# Altium project USBHub3.2G1.PrjPcb
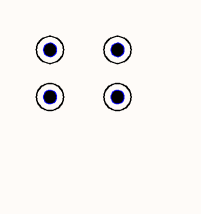
[diagram p0: Schematic.SchDoc, top left]
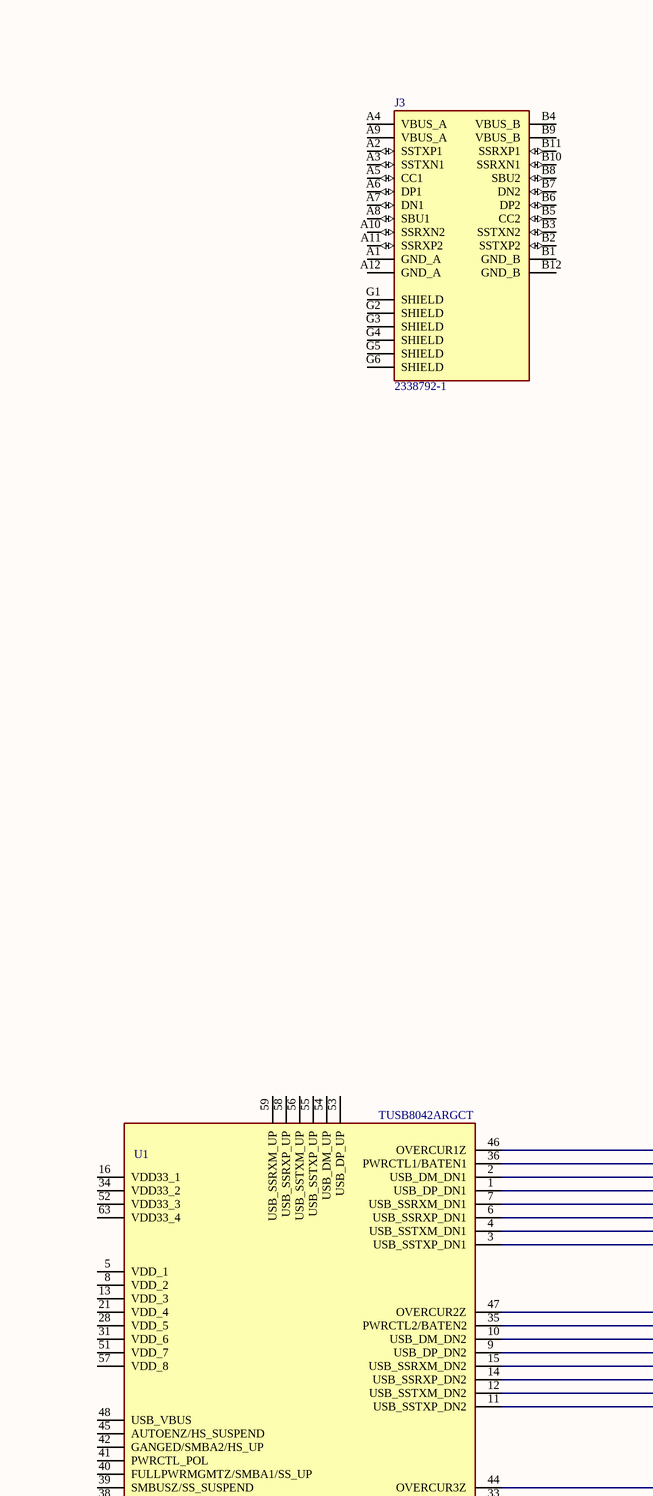
[diagram p1: Schematic.SchDoc, top middle]
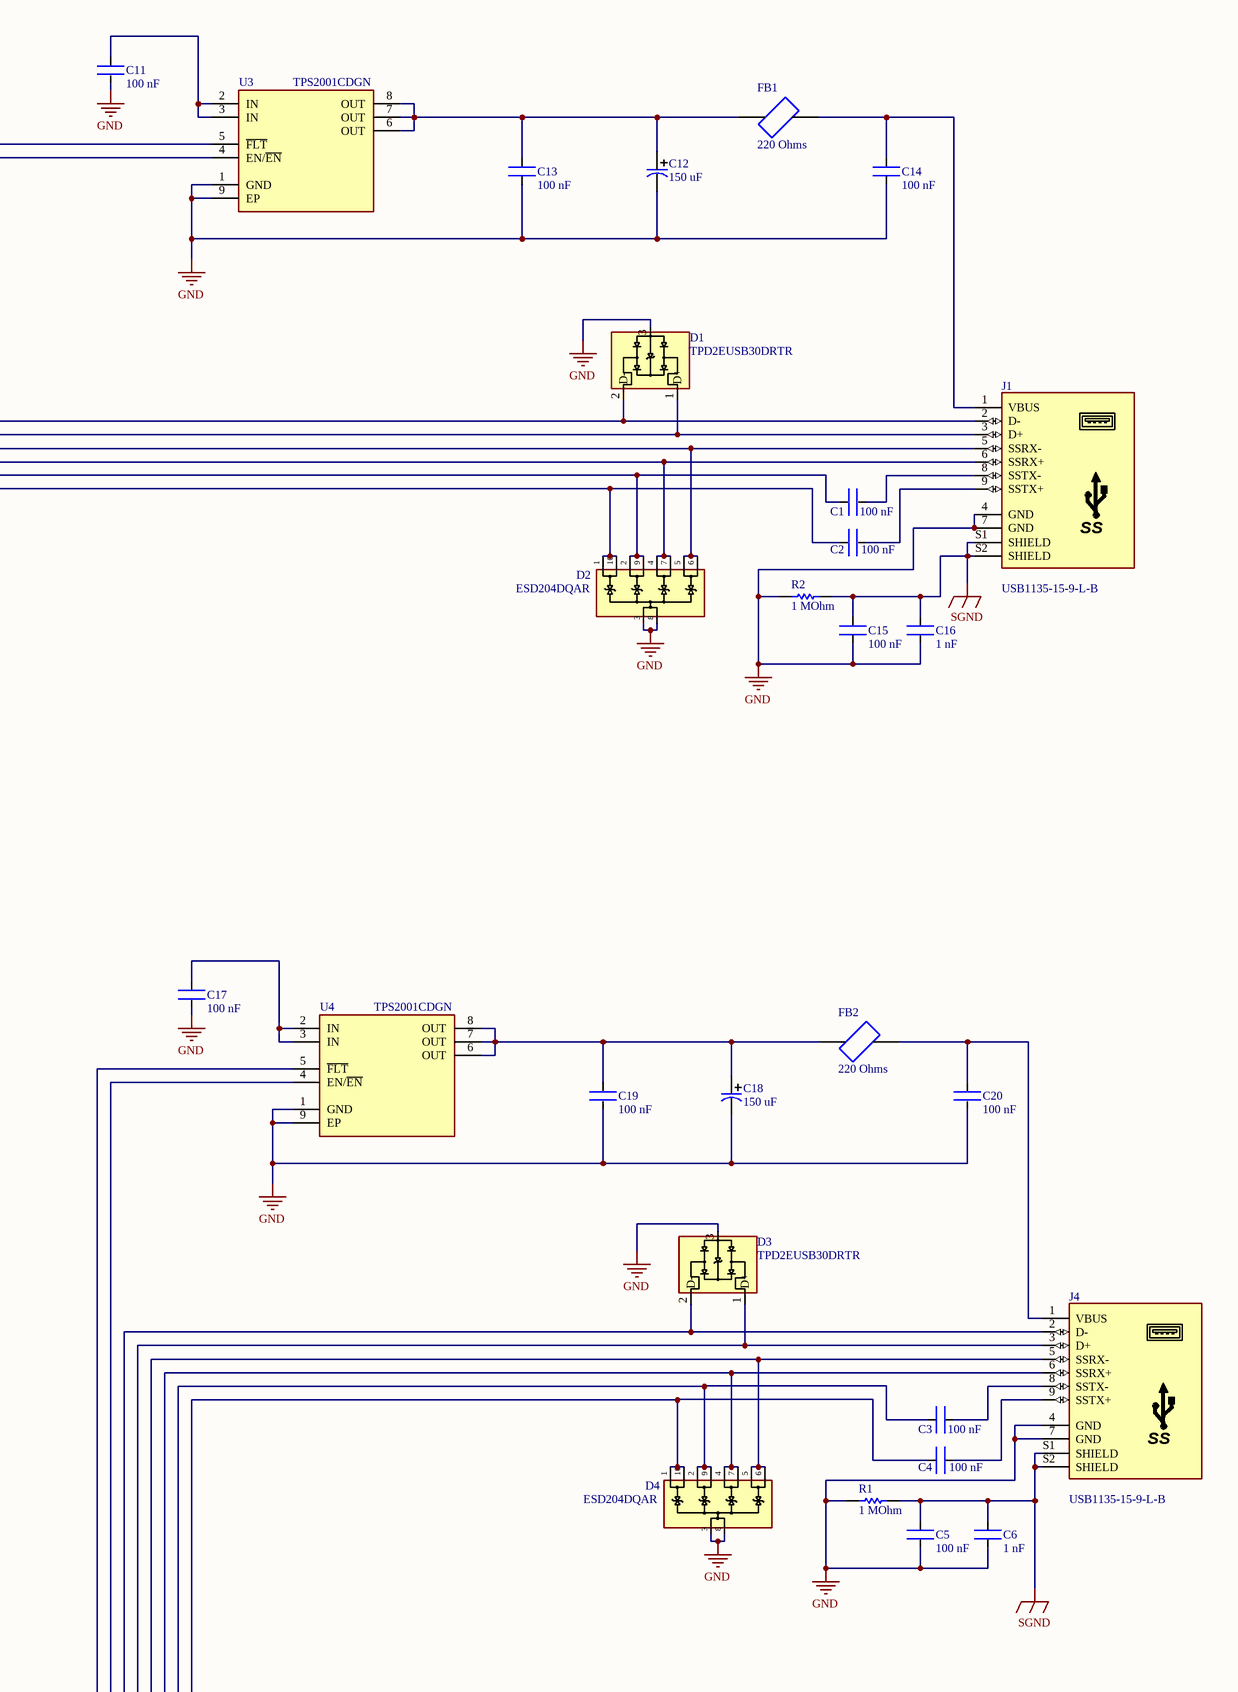
[diagram p2: Schematic.SchDoc, top right]
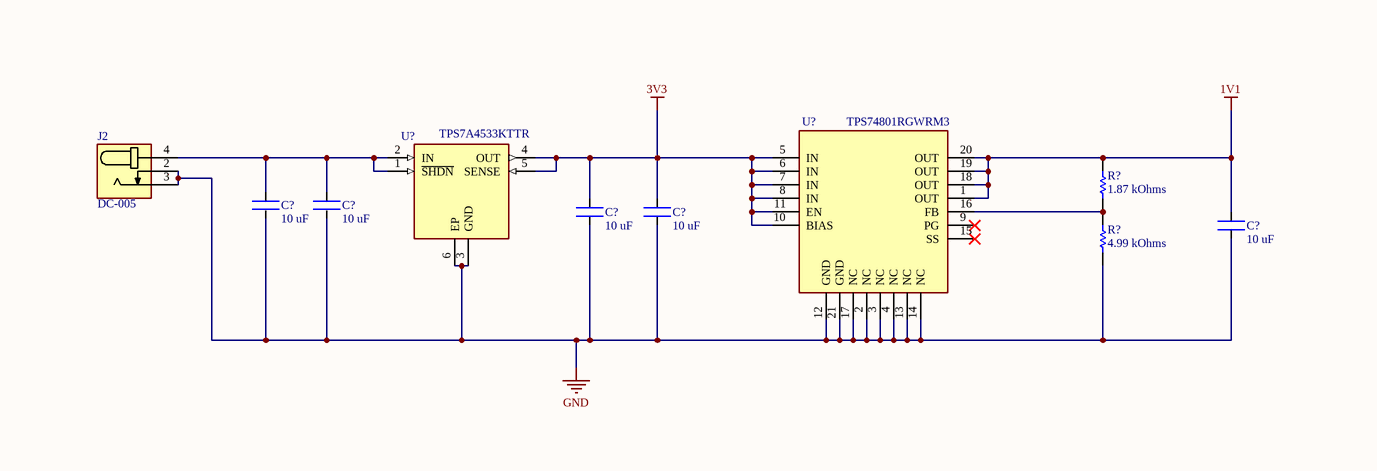
[diagram p3: Schematic.SchDoc, bottom left]
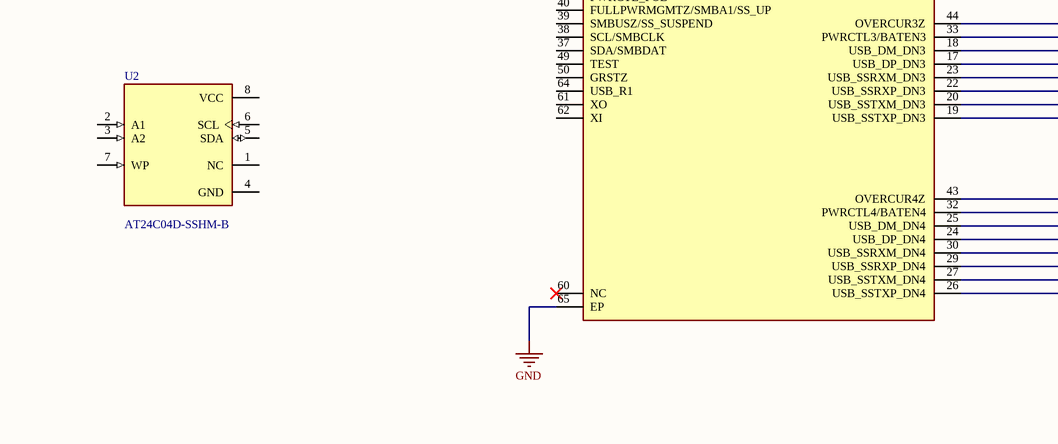
[diagram p4: Schematic.SchDoc, bottom middle]
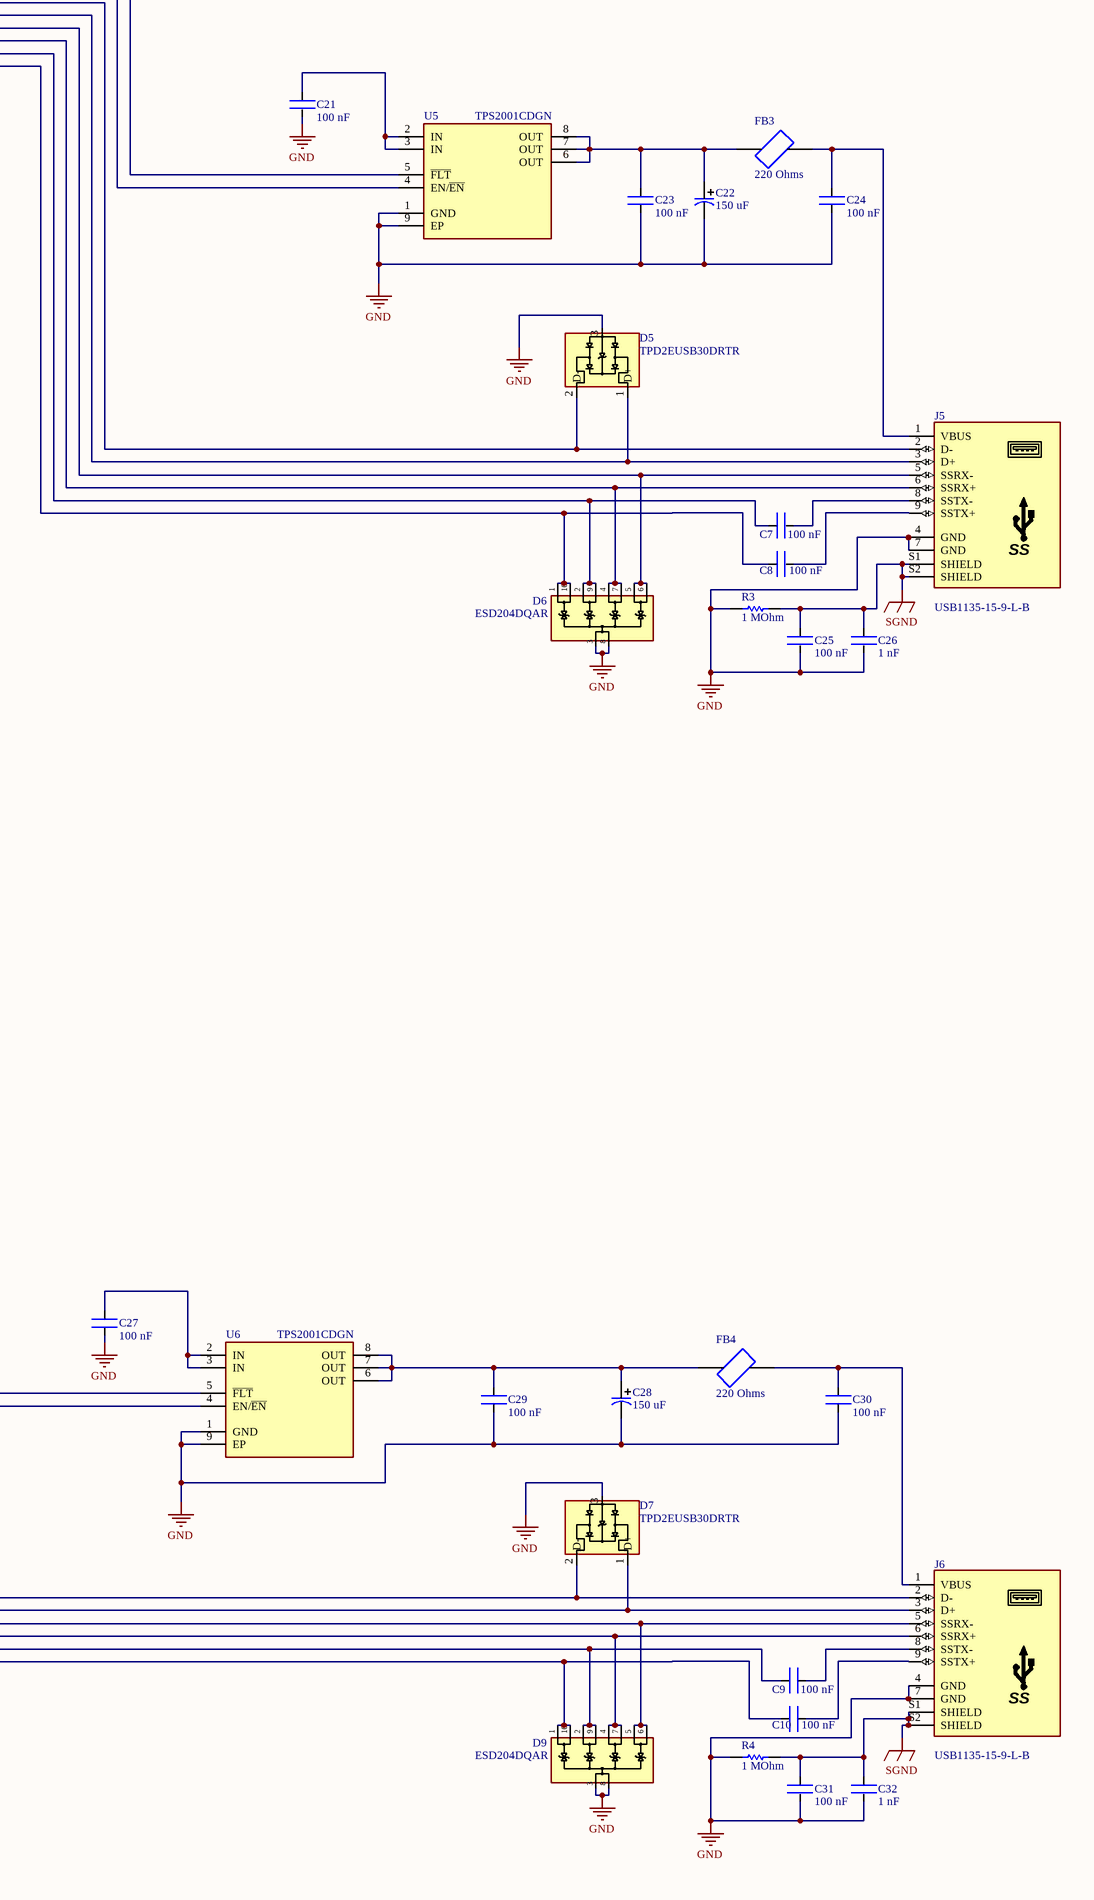
[diagram p5: Schematic.SchDoc, bottom right]
1 sheet, 73 parts. Net scope: global (net labels, ports and power ports of the same name join across sheets).
Board file: USBHub3.2G1.PcbDoc

## Sheet Schematic.SchDoc
size A0; SheetNumber: 1; SheetTotal: 1

### Parts
(Parts that share a designator on the sheet are numbered #1, #2 ... from top to bottom, then left to right.)
#1  Furo  [FURO_M2]  (value not drawn)
#2  Furo  [FURO_M2]  (value not drawn)
#3  Furo  [FURO_M2]  (value not drawn)
#4  Furo  [FURO_M2]  (value not drawn)
C1  value 100 nF  [0201]  (hidden comment: CAPNPOL)
C2  value 100 nF  [0201]  (hidden comment: CAPNPOL)
C3  value 100 nF  [0201]  (hidden comment: CAPNPOL)
C4  value 100 nF  [0201]  (hidden comment: CAPNPOL)
C5  value 100 nF  [0402]  (hidden comment: CAPNPOL)
C6  value 1 nF  [0402]  (hidden comment: CAPNPOL)
C7  value 100 nF  [0201]  (hidden comment: CAPNPOL)
C8  value 100 nF  [0201]  (hidden comment: CAPNPOL)
C9  value 100 nF  [0201]  (hidden comment: CAPNPOL)
C10  value 100 nF  [0201]  (hidden comment: CAPNPOL)
C11  value 100 nF  [0402]  (hidden comment: CAPNPOL)
C12  value 150 uF  [TCJB157M006R0070]  (hidden comment: CAPPOL)
C13  value 100 nF  [0402]  (hidden comment: CAPNPOL)
C14  value 100 nF  [0402]  (hidden comment: CAPNPOL)
C15  value 100 nF  [0402]  (hidden comment: CAPNPOL)
C16  value 1 nF  [0402]  (hidden comment: CAPNPOL)
C17  value 100 nF  [0402]  (hidden comment: CAPNPOL)
C18  value 150 uF  [TCJB157M006R0070]  (hidden comment: CAPPOL)
C19  value 100 nF  [0402]  (hidden comment: CAPNPOL)
C20  value 100 nF  [0402]  (hidden comment: CAPNPOL)
C21  value 100 nF  [0402]  (hidden comment: CAPNPOL)
C22  value 150 uF  [TCJB157M006R0070]  (hidden comment: CAPPOL)
C23  value 100 nF  [0402]  (hidden comment: CAPNPOL)
C24  value 100 nF  [0402]  (hidden comment: CAPNPOL)
C25  value 100 nF  [0402]  (hidden comment: CAPNPOL)
C26  value 1 nF  [0402]  (hidden comment: CAPNPOL)
C27  value 100 nF  [0402]  (hidden comment: CAPNPOL)
C28  value 150 uF  [TCJB157M006R0070]  (hidden comment: CAPPOL)
C29  value 100 nF  [0402]  (hidden comment: CAPNPOL)
C30  value 100 nF  [0402]  (hidden comment: CAPNPOL)
C31  value 100 nF  [0402]  (hidden comment: CAPNPOL)
C32  value 1 nF  [0402]  (hidden comment: CAPNPOL)
C?#1  value 10 uF  [0402]  (hidden comment: CAPNPOL)
C?#2  value 10 uF  [0402]  (hidden comment: CAPNPOL)
C?#3  value 10 uF  [0402]  (hidden comment: CAPNPOL)
C?#4  value 10 uF  [0402]  (hidden comment: CAPNPOL)
C?#5  value 10 uF  [0402]  (hidden comment: CAPNPOL)
D1  TPD2EUSB30DRTR  [DRT_(R-PDSO-N3)]
D2  ESD204DQAR  [DQA0010A]
D3  TPD2EUSB30DRTR  [DRT_(R-PDSO-N3)]
D4  ESD204DQAR  [DQA0010A]
D5  TPD2EUSB30DRTR  [DRT_(R-PDSO-N3)]
D6  ESD204DQAR  [DQA0010A]
D7  TPD2EUSB30DRTR  [DRT_(R-PDSO-N3)]
D9  ESD204DQAR  [DQA0010A]
FB1  imepdancia: 220 Ohms  [FB0603]  (hidden comment: FerriteBead)
FB2  imepdancia: 220 Ohms  [FB0603]  (hidden comment: FerriteBead)
FB3  imepdancia: 220 Ohms  [FB0603]  (hidden comment: FerriteBead)
FB4  imepdancia: 220 Ohms  [FB0603]  (hidden comment: FerriteBead)
J1  USB1135-15-9-L-B  [USB1135-15-9-L-B]
J2  DC-005  [DC-005]
J3  2338792-1  [2338792-1]
J4  USB1135-15-9-L-B  [USB1135-15-9-L-B]
J5  USB1135-15-9-L-B  [USB1135-15-9-L-B]
J6  USB1135-15-9-L-B  [USB1135-15-9-L-B]
R1  value 1 MOhm  [R0402]  (hidden comment: Resistor)
R2  value 1 MOhm  [R0402]  (hidden comment: Resistor)
R3  value 1 MOhm  [R0402]  (hidden comment: Resistor)
R4  value 1 MOhm  [R0402]  (hidden comment: Resistor)
R?#1  value 1.87 kOhms  [R0402]  (hidden comment: Resistor)
R?#2  value 4.99 kOhms  [R0402]  (hidden comment: Resistor)
U1  TUSB8042ARGCT  [RGC0064G]
U2  AT24C04D-SSHM-B  [SOIC-8]
U3  TPS2001CDGN  [DGN0008G]
U4  TPS2001CDGN  [DGN0008G]
U5  TPS2001CDGN  [DGN0008G]
U6  TPS2001CDGN  [DGN0008G]
U?#1  TPS74801RGWRM3  [RGW0020A]
U?#2  TPS7A4533KTTR  [R-PSFM-G5]

### Nets
1V1: C?#5.1 R?#1.2 U?#1.1(OUT) U?#1.18(OUT) U?#1.19(OUT) U?#1.20(OUT)
3V3: C?#3.1 C?#4.1 U?#1.5(IN) U?#1.6(IN) U?#1.7(IN) U?#1.8(IN) U?#1.10(BIAS) U?#1.11(EN) U?#2.4(OUT) U?#2.5(SENSE)
GND: C5.2 C6.2 C11.2 C12.2 C13.2 C14.2 C15.2 C16.2 C17.2 C18.2 C19.2 C20.2 C21.2 C22.2 C23.2 C24.2 C25.2 C26.2 C27.2 C28.2 C29.2 C30.2 C31.2 C32.2 C?#1.2 C?#2.2 C?#3.2 C?#4.2 C?#5.2 D1.3(GND) D2.3(GND_3) D2.8(GND_8) D3.3(GND) D4.3(GND_3) D4.8(GND_8) D5.3(GND) D6.3(GND_3) D6.8(GND_8) D7.3(GND) D9.3(GND_3) D9.8(GND_8) J1.4(GND) J1.7(GND) J2.2 J2.3 J4.4(GND) J4.7(GND) J5.4(GND) J5.7(GND) J6.4(GND) J6.7(GND) R1.1 R2.1 R3.1 R4.1 R?#2.1 U1.65(EP) U3.1(GND) U3.9(EP) U4.1(GND) U4.9(EP) U5.1(GND) U5.9(EP) U6.1(GND) U6.9(EP) U?#1.2(NC) U?#1.3(NC) U?#1.4(NC) U?#1.12(GND) U?#1.13(NC) U?#1.14(NC) U?#1.17(NC) U?#1.21(GND) U?#2.3(GND) U?#2.6(EP)
SGND: C5.1 C6.1 C15.1 C16.1 C25.1 C26.1 C31.1 C32.1 J1.S1(SHIELD) J1.S2(SHIELD) J4.S1(SHIELD) J4.S2(SHIELD) J5.S1(SHIELD) J5.S2(SHIELD) J6.S1(SHIELD) J6.S2(SHIELD) R1.2 R2.2 R3.2 R4.2
NetC1_1: C1.1 D2.2(IO2) D2.9(NC_9) U1.4(USB_SSTXM_DN1)
NetC1_2: C1.2 J1.8(SSTX-)
NetC2_1: C2.1 D2.1(IO1) D2.10(NC_10) U1.3(USB_SSTXP_DN1)
NetC2_2: C2.2 J1.9(SSTX+)
NetC3_1: C3.1 D4.2(IO2) D4.9(NC_9) U1.12(USB_SSTXM_DN2)
NetC3_2: C3.2 J4.8(SSTX-)
NetC4_1: C4.1 D4.1(IO1) D4.10(NC_10) U1.11(USB_SSTXP_DN2)
NetC4_2: C4.2 J4.9(SSTX+)
NetC7_1: C7.1 D6.2(IO2) D6.9(NC_9) U1.20(USB_SSTXM_DN3)
NetC7_2: C7.2 J5.8(SSTX-)
NetC8_1: C8.1 D6.1(IO1) D6.10(NC_10) U1.19(USB_SSTXP_DN3)
NetC8_2: C8.2 J5.9(SSTX+)
NetC9_1: C9.1 D9.2(IO2) D9.9(NC_9) U1.27(USB_SSTXM_DN4)
NetC9_2: C9.2 J6.8(SSTX-)
NetC10_1: C10.1 D9.1(IO1) D9.10(NC_10) U1.26(USB_SSTXP_DN4)
NetC10_2: C10.2 J6.9(SSTX+)
NetC11_1: C11.1 U3.2(IN) U3.3(IN)
NetC12_1: C12.1 C13.1 FB1.1 U3.6(OUT) U3.7(OUT) U3.8(OUT)
NetC14_1: C14.1 FB1.2 J1.1(VBUS)
NetC17_1: C17.1 U4.2(IN) U4.3(IN)
NetC18_1: C18.1 C19.1 FB2.1 U4.6(OUT) U4.7(OUT) U4.8(OUT)
NetC20_1: C20.1 FB2.2 J4.1(VBUS)
NetC21_1: C21.1 U5.2(IN) U5.3(IN)
NetC22_1: C22.1 C23.1 FB3.1 U5.6(OUT) U5.7(OUT) U5.8(OUT)
NetC24_1: C24.1 FB3.2 J5.1(VBUS)
NetC27_1: C27.1 U6.2(IN) U6.3(IN)
NetC28_1: C28.1 C29.1 FB4.1 U6.6(OUT) U6.7(OUT) U6.8(OUT)
NetC30_1: C30.1 FB4.2 J6.1(VBUS)
NetC?#1_1: C?#1.1 C?#2.1 J2.4 U?#2.1(~{SHDN}) U?#2.2(IN)
NetD1_1: D1.1(D+) J1.3(D+) U1.1(USB_DP_DN1)
NetD1_2: D1.2(D-) J1.2(D-) U1.2(USB_DM_DN1)
NetD2_4: D2.4(IO3) D2.7(NC_7) J1.6(SSRX+) U1.6(USB_SSRXP_DN1)
NetD2_5: D2.5(IO4) D2.6(NC_6) J1.5(SSRX-) U1.7(USB_SSRXM_DN1)
NetD3_1: D3.1(D+) J4.3(D+) U1.9(USB_DP_DN2)
NetD3_2: D3.2(D-) J4.2(D-) U1.10(USB_DM_DN2)
NetD4_4: D4.4(IO3) D4.7(NC_7) J4.6(SSRX+) U1.14(USB_SSRXP_DN2)
NetD4_5: D4.5(IO4) D4.6(NC_6) J4.5(SSRX-) U1.15(USB_SSRXM_DN2)
NetD5_1: D5.1(D+) J5.3(D+) U1.17(USB_DP_DN3)
NetD5_2: D5.2(D-) J5.2(D-) U1.18(USB_DM_DN3)
NetD6_4: D6.4(IO3) D6.7(NC_7) J5.6(SSRX+) U1.22(USB_SSRXP_DN3)
NetD6_5: D6.5(IO4) D6.6(NC_6) J5.5(SSRX-) U1.23(USB_SSRXM_DN3)
NetD7_1: D7.1(D+) J6.3(D+) U1.24(USB_DP_DN4)
NetD7_2: D7.2(D-) J6.2(D-) U1.25(USB_DM_DN4)
NetD9_4: D9.4(IO3) D9.7(NC_7) J6.6(SSRX+) U1.29(USB_SSRXP_DN4)
NetD9_5: D9.5(IO4) D9.6(NC_6) J6.5(SSRX-) U1.30(USB_SSRXM_DN4)
NetR?#1_1: R?#1.1 R?#2.2 U?#1.16(FB)
NetU1_32: U1.32(PWRCTL4/BATEN4) U6.4(EN/~{EN})
NetU1_33: U1.33(PWRCTL3/BATEN3) U5.4(EN/~{EN})
NetU1_35: U1.35(PWRCTL2/BATEN2) U4.4(EN/~{EN})
NetU1_36: U1.36(PWRCTL1/BATEN1) U3.4(EN/~{EN})
NetU1_43: U1.43(OVERCUR4Z) U6.5(~{FLT})
NetU1_44: U1.44(OVERCUR3Z) U5.5(~{FLT})
NetU1_46: U1.46(OVERCUR1Z) U3.5(~{FLT})
NetU1_47: U1.47(OVERCUR2Z) U4.5(~{FLT})

Not connected (* = marked no-connect by the designer): J3 A1(GND_A) A2(SSTXP1) A3(SSTXN1) A4(VBUS_A) A5(CC1) A6(DP1) A7(DN1) A8(SBU1) A9(VBUS_A) A10(SSRXN2) A11(SSRXP2) A12(GND_A) B1(GND_B) B2(SSTXP2) B3(SSTXN2) B4(VBUS_B) B5(CC2) B6(DP2) B7(DN2) B8(SBU2) B9(VBUS_B) B10(SSRXN1) B11(SSRXP1) B12(GND_B) G1(SHIELD) G2(SHIELD) G3(SHIELD) G4(SHIELD) G5(SHIELD) G6(SHIELD); U1 5(VDD_1) 8(VDD_2) 13(VDD_3) 16(VDD33_1) 21(VDD_4) 28(VDD_5) 31(VDD_6) 34(VDD33_2) 37(SDA/SMBDAT) 38(SCL/SMBCLK) 39(SMBUSZ/SS_SUSPEND) 40(FULLPWRMGMTZ/SMBA1/SS_UP) 41(PWRCTL_POL) 42(GANGED/SMBA2/HS_UP) 45(AUTOENZ/HS_SUSPEND) 48(USB_VBUS) 49(TEST) 50(GRSTZ) 51(VDD_7) 52(VDD33_3) 53(USB_DP_UP) 54(USB_DM_UP) 55(USB_SSTXP_UP) 56(USB_SSTXM_UP) 57(VDD_8) 58(USB_SSRXP_UP) 59(USB_SSRXM_UP) 60(NC)* 61(XO) 62(XI) 63(VDD33_4) 64(USB_R1); U2 1(NC) 2(A1) 3(A2) 4(GND) 5(SDA) 6(SCL) 7(WP) 8(VCC); U?#1 9(PG)* 15(SS)*

### Notes on the sheet
- (in symbol USB1135-15-9-L-B) SS

### Library data of the parts
#1-#4 = FURO_M2: Furo para parafuso M2
C1-C4 C7-C10 = GRT033R61C104KE01D: Multilayer Ceramic Capacitors MLCC - SMD/SMT 0.1 uF 16 VDC 10% 0201 X5R AEC-Q200; Manufacter: Murata Electronics; Polarizado/Não polarizado: Não polarizado; Montagem: SMD; Sub-Tipo: Ceramico; Part Number: GRT033R61C104KE01D; Nome: GRT033R61C104KE01D; Package: 0201; Supplier 1: Mouser; Supplier Part Number 1: 81-GRT033R61C104KE1D; Supplier 2: Digikey; Supplier Part Number 2: 490-GRT033R61C104KE01DCT-ND; Supplier 3: LCSC; Supplier Part Number 3: C6955435
C5 C11 C13-C15 C17 C19-C21 C23-C25 C27 C29-C31 = GRT155R71C104KE01J: Multilayer Ceramic Capacitors MLCC - SMD/SMT 0.1 uF 16 VDC 10% 0402 X7R AEC-Q200; Manufacter: Murata Electronics; Polarizado/Não polarizado: Não polarizado; Montagem: SMD; Sub-Tipo: Ceramico; Part Number: GRT155R71C104KE01J; Nome: GRT155R71C104KE01J; Package: 0402; Supplier 1: Mouser; Supplier Part Number 1: 81-GRT155R71C104KE1J; Supplier 2: Digikey; Supplier Part Number 2: 490-GRT155R71C104KE01JCT-ND; Supplier 3: LCSC; Supplier Part Number 3: C3841254
C6 C16 C26 C32 = GCM155R72A102KA37J: Multilayer Ceramic Capacitors MLCC - SMD/SMT 1000 pF 100 VDC 10% 0402 X7R AEC-Q200; Manufacter: Murata Electronics; Polarizado/Não polarizado: Não polarizado; Montagem: SMD; Sub-Tipo: Ceramico; Part Number: GCM155R72A102KA37J; Nome: GCM155R72A102KA37J; Package: 0402; Supplier 1: Mouser; Supplier Part Number 1: 81-GCM155R72A102KA7J; Supplier 2: Digikey; Supplier Part Number 2: 490-GRT155R71C104KE01JCT-ND; Supplier 3: LCSC; Supplier Part Number 3: C3841254
C12 C18 C22 C28 = TCJB157M006R0070: Tantalum Capacitors - Polymer 6.3V 150uF 20% 1210 ESR=70mOhm; Manufacter: KYOCERA AVX; Polarizado/Não polarizado: Polarizado; Montagem: SMD; Sub-Tipo: Tântalo; Part Number: TCJB157M006R0070; Nome: TCJB157M006R0070; Package: TCJB157M006R0070; Supplier 1: Mouser; Supplier Part Number 1: 581-TCJB157M006R0070; Supplier 2: Digikey; Supplier Part Number 2: 478-4921-1-ND; Supplier 3: LCSC; Supplier Part Number 3: C24904
C?#1-C?#5 = GRM155R61A106ME11D: Multilayer Ceramic Capacitors MLCC - SMD/SMT 10 uF 10 VDC 20% 0402 X5R; Manufacter: Murata Electronics; Polarizado/Não polarizado: Não polarizado; Montagem: SMD; Sub-Tipo: Ceramico; Part Number: GRM155R61A106ME11D; Nome: GRM155R61A106ME11D; Package: 0402; Supplier 1: Mouser; Supplier Part Number 1: 81-GRM155R61A106ME1D; Supplier 2: Digikey; Supplier Part Number 2: 490-GRM155R61A106ME11DCT-ND; Supplier 3: LCSC; Supplier Part Number 3: C408132
D1 D3 D5 D7 = TPD2EUSB30DRTR: ESD Protection Diodes / TVS Diodes 2Ch ESD Solution; Manufacter: Texas Instruments; Montagem: SMD; Breakdown Voltage: 7 V; Peak Pulse Current: 5 A; Peak Pulse Power Dissipation: 45 W; Part Number: TPD2EUSB30DRTR; Nome: TPD2EUSB30DRTR; Bidirecional/Unidirecional: TPD2EUSB30DRTR; Package: DRT_(R-PDSO-N3); Supplier 1: Mouser; Supplier Part Number 1: 595-TPD2EUSB30DRTR; Supplier 2: Digikey; Supplier Part Number 2: 296-25509-1-ND; Supplier 3: LCSC; Supplier Part Number 3: TPD2EUSB30DRTR
D2 D4 D6 D9 = ESD204DQAR: ESD Protection Diodes / TVS Diodes Quad 0.55-pF +/-3.6 -V +/-30-kV ESD pro; Manufacter: Texas Instruments; Montagem: SMD; Breakdown Voltage: 7.9 V; Peak Pulse Current: 5.5 A; Peak Pulse Power Dissipation: 50 W; Part Number: ESD204DQAR; Nome: ESD204DQAR; Bidirecional/Unidirecional: ESD204DQAR; Package: DQA0010A; Supplier 1: Mouser; Supplier Part Number 1: 595-ESD204DQAR; Supplier 2: Digikey; Supplier Part Number 2: 296-49504-1-ND; Supplier 3: LCSC; Supplier Part Number 3: C553132
FB1-FB4 = BLM18KG221SH1D: Ferrite Beads 220 OHM Alternate Sizing Guide Below; Manufacter: Murata Electronics; Corrente Max: 2.2 A; Tolerancia: 25%; Part Number: BLM18KG221SH1D; Nome: BLM18KG221SH1D; Package: 0603; Supplier 1: Mouser; Supplier Part Number 1: 81-BLM18KG221SH1D; Supplier 2: Digikey; Supplier Part Number 2: 490-13256-1-ND; Supplier 3: LCSC; Supplier Part Number 3: C527991; Tipo: Ferrite Bead
J1 J4-J6 = USB1135-15-9-L-B: USB Connectors USB A 3.0 Skt RA High Life 15u" T Hole W/Shell Stake Tray; Manufacter: GCT; Montagem: PTH; Colunas: 0; Total de Pinos: 11; Part Number: USB1135-15-9-L-B; Nome: USB1135-15-9-L-B; Pinos por coluna: 0; Sub-Tipo: USB; Supplier 1: Mouser; Supplier Part Number 1: 640-USB1135-15-9-L-B; Supplier 2: Digikey; Supplier Part Number 2: 2073-USB1135-15-9-L-B-ND; Supplier 3: LCSC; Supplier Part Number 3: C5456888
J2 = DC-005: DC Jack; Manufacter: Generic; Montagem: PTH; Colunas: 0; Total de Pinos: 3; Part Number: DC-005; Nome: DC-005; Pinos por coluna: 3; Sub-Tipo: DC Jack
J3 = 2338792-1: USB Connectors USB TYPE C 3.1 CONN REV TOP MOUNT CH1.6; Manufacter: TE Connectivity; Montagem: PTH/SMD; Colunas: 0; Total de Pinos: 24; Part Number: 2338792-1; Nome: 2338792-1; Pinos por coluna: 0; Sub-Tipo: USB; Supplier 1: Mouser; Supplier Part Number 1: 571-2338792-1; Supplier 2: Digikey; Supplier Part Number 2: 17-2338792-1CT-ND; Supplier 3: LCSC; Supplier Part Number 3: C6077276
R1-R4 = CRCW04021M00FKEE: Thick Film Resistors 1M OHM 1%; Manufacter: Vishay; Potencia: 62.5 mW; Montagem: SMD; Part Number: CRCW04021M00FKEE; Nome: CRCW04021M00FKEE; Package: 0402; Tolerancia: 1%; Supplier 1: Mouser; Supplier Part Number 1: 71-CRCW04021M00FKEE; Supplier 2: Digikey; Supplier Part Number 2: 541-CRCW04021M00FKEECT-ND; Supplier 3: LCSC; Supplier Part Number 3: C4207375; Simbolo: Resistor
R?#1 = AC0402FR-071K87L: Thick Film Resistors 1.87 kOhms 1/16 W 50 V 1% 0402 100 PPM / C - 55 C + 155 C AEC-Q200; Manufacter: YAGEO; Potencia: 62.5 mW; Montagem: SMD; Part Number: AC0402FR-071K87L; Nome: AC0402FR-071K87L; Package: 0402; Tolerancia: 1%; Supplier 1: Mouser; Supplier Part Number 1: 603-AC0402FR-071K87L; Supplier 2: Digikey; Supplier Part Number 2: YAG5270CT-ND; Supplier 3: LCSC; Supplier Part Number 3: C705744; Simbolo: Resistor
R?#2 = RT0402BRD074K99L: Thin Film Resistors 1/16W 4.99K ohm .1% 25ppm; Manufacter: YAGEO; Potencia: 62.5 mW; Tolerancia: 1%; Montagem: SMD; Part Number: RT0402BRD074K99L; Nome: RT0402BRD074K99L; Package: 0402; Supplier 1: Mouser; Supplier Part Number 1: 603-RT0402BRD074K99L; Supplier 2: Digikey; Supplier Part Number 2: YAG1447CT-ND; Supplier 3: LCSC; Supplier Part Number 3: C852823; Simbolo: Resistor
U1 = TUSB8042ARGCT: USB Interface IC Four-port USB 3.2 x1 gen1 hub 64-VQFN 0 A 595-TUSB8042ARGCR; Manufacter: Texas Instruments; Montagem: SMD; Sub-Tipo: USB HUB; Part Number: TUSB8042ARGCT; Nome: TUSB8042ARGCT; Package: RGC0064G; Supplier 1: Mouser; Supplier Part Number 1: 595-TUSB8042ARGCT; Supplier 2: Digikey; Supplier Part Number 2: 296-TUSB8042ARGCT-ND; Supplier 3: LCSC; Supplier Part Number 3: C2678051
U2 = AT24C04D-SSHM-B: EEPROM 1.7-3.6V, 1MHz, Ind Tmp, 8-SOIC-N; Manufacter: Microchip Technology; Montagem: SMD; Sub-Tipo: Memoria; Part Number: AT24C04D-SSHM-B; Nome: AT24C04D-SSHM-B; Package: SOIC-8; Supplier 1: Mouser; Supplier Part Number 1: 556-AT24C04D-SSHM-B; Supplier 2: Digikey; Supplier Part Number 2: AT24C04D-SSHM-B-ND; Supplier 3: LCSC; Supplier Part Number 3: C1349373
U3-U6 = TPS2001CDGN: Power Switch ICs - Power Distribution SGL CH CURRENT-LTD U SB PWR DISTR SWITCH A 595-TPS2001CDGNR; Manufacter: Texas Instruments; Montagem: SMD; Sub-Tipo: Conversor DC/DC; Part Number: TPS2001CDGN; Nome: TPS2001CDGN; Package: DGN0008G; Supplier 1: Mouser; Supplier Part Number 1: 595-TPS2001CDGN; Supplier 2: Digikey; Supplier Part Number 2: 296-29336-5-ND; Supplier 3: LCSC; Supplier Part Number 3: C206204
U?#1 = TPS74801RGWRM3: Linear Voltage Regulators 1.5-A low-VIN (0.8 V ) adjustable low-dro; Manufacter: Texas Instruments; Montagem: SMD; Sub-Tipo: Regulador LDO; Part Number: TPS74801RGWRM3; Nome: TPS74801RGWRM3; Package: RGW0020A; Supplier 1: Mouser; Supplier Part Number 1: 595-TPS74801RGWRM3; Supplier 2: Digikey; Supplier Part Number 2: 296-TPS74801RGWRM3CT-ND
U?#2 = TPS7A4533KTTR: LDO Voltage Regulators Low-Noise Fast Trans -Resp 1.5A; Manufacter: Texas Instruments; Montagem: SMD; Sub-Tipo: Regulador LDO; Part Number: TPS7A4533KTTR; Nome: TPS7A4533KTTR; Package: R-PSFM-G5; Supplier 1: Mouser; Supplier Part Number 1: 595-TPS7A4533KTTR; Supplier 2: Digikey; Supplier Part Number 2: 296-23755-1-ND; Supplier 3: LCSC; Supplier Part Number 3: C2865625